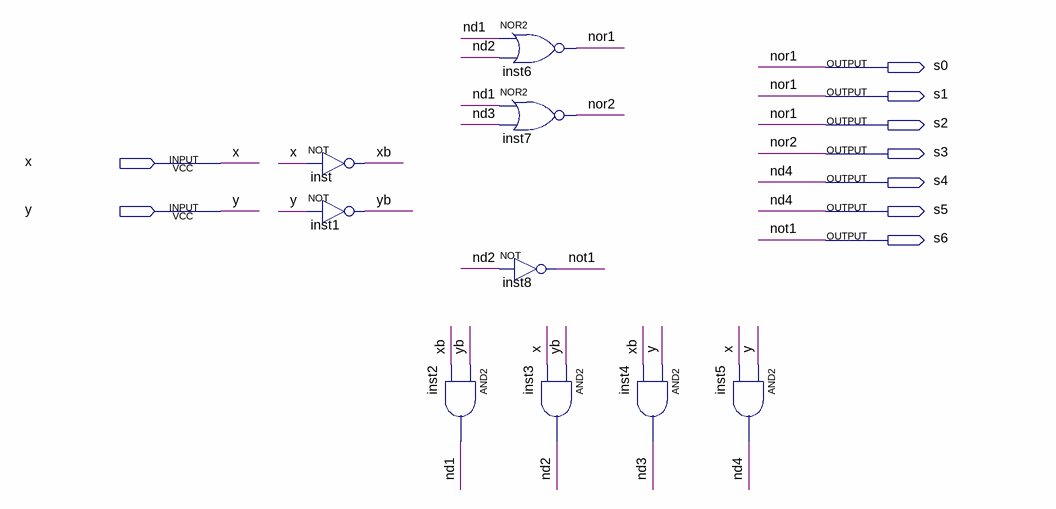
[diagram p0: schematic sheet]
// Quartus schematic projeto_alf.bdf as structural Verilog: 9 symbols, 9 pins
module projeto_alf (
  input  x,
  input  y,
  output s0,
  output s1,
  output s2,
  output s3,
  output s4,
  output s5,
  output s6
);

  wire nd1, nd2, nd3, xb, yb;

  not inst (xb, x);
  not inst1 (yb, y);
  and inst2 (nd1, yb, xb);
  nor inst6 (s0, nd1, nd2);
  nor inst7 (s3, nd1, nd3);
  not inst8 (s6, nd2);
  and inst3 (nd2, yb, x);
  and inst4 (nd3, y, xb);
  and inst5 (s4, y, x);

  assign s1 = s0;
  assign s2 = s0;
  assign s5 = s4;

  // Other names for the same wires on the sheet: nd4 = s4; nor1 = s0; nor2 = s3; not1 = s6
endmodule
